# EAGLE schematic LM13700 VCA (EAGLE 7.4.0)
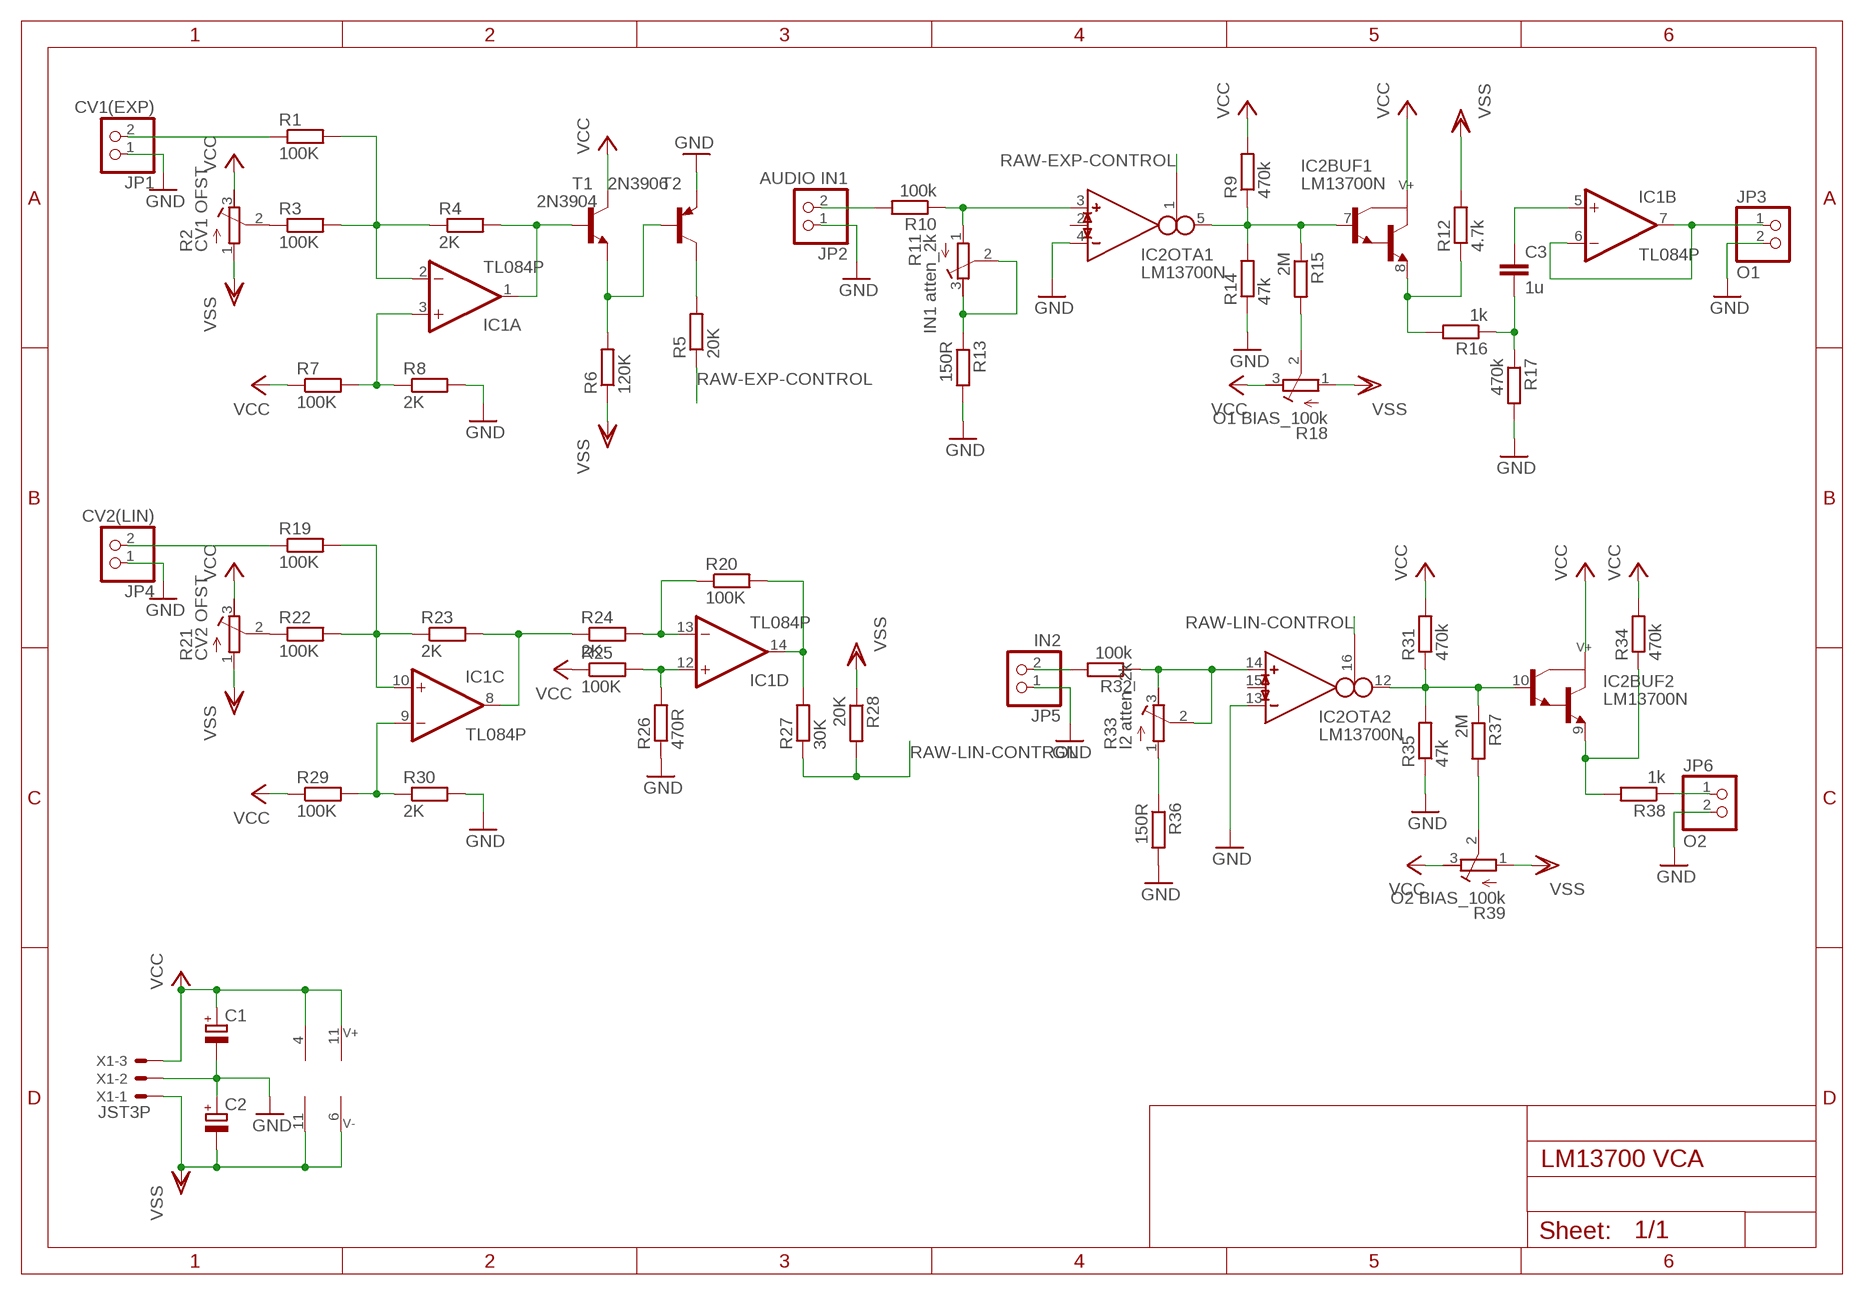
[diagram p0: schematic, sheet 1]

## Parts
C1  CPOL-EUE2.5-7  [E2,5-7]
C2  CPOL-EUE2.5-7  [E2,5-7]
C3  1u  C-EU050-025X075  [C050-025X075]
IC1  TL084P  [DIL14]
IC2  LM13700N  [DIL16]
JP1  CV1(EXP)  PINHD-1X2  [1X02]
JP2  AUDIO IN1  PINHD-1X2  [1X02]
JP3  O1  PINHD-1X2  [1X02]
JP4  CV2(LIN)  PINHD-1X2  [1X02]
JP5  IN2  PINHD-1X2  [1X02]
JP6  O2  PINHD-1X2  [1X02]
R1  100K  R-EU_0204/7  [0204/7]
R2  CV1 OFST  R-TRIMM64W  [RTRIM64W]
R3  100K  R-EU_0204/7  [0204/7]
R4  2K  R-EU_0204/2V  [0204V]
R5  20K  R-EU_0204/7  [0204/7]
R6  120K  R-EU_0204/7  [0204/7]
R7  100K  R-EU_0204/7  [0204/7]
R8  2K  R-EU_0204/7  [0204/7]
R9  470k  R-EU_0204/7  [0204/7]
R10  100k  R-EU_0204/2V  [0204V]
R11  IN1 atten_2k  R-TRIMM64W  [RTRIM64W]
R12  4.7k  R-EU_0204/7  [0204/7]
R13  150R  R-EU_0204/2V  [0204V]
R14  47k  R-EU_0204/7  [0204/7]
R15  2M  R-EU_0204/7  [0204/7]
R16  1k  R-EU_0204/7  [0204/7]
R17  470k  R-EU_0204/7  [0204/7]
R18  O1 BIAS_100k  R-TRIMM64W  [RTRIM64W]
R19  100K  R-EU_0204/7  [0204/7]
R20  100K  R-EU_0204/2V  [0204V]
R21  CV2 OFST  R-TRIMM64W  [RTRIM64W]
R22  100K  R-EU_0204/7  [0204/7]
R23  2K  R-EU_0204/7  [0204/7]
R24  2K  R-EU_0204/7  [0204/7]
R25  100K  R-EU_0204/7  [0204/7]
R26  470R  R-EU_0204/7  [0204/7]
R27  30K  R-EU_0204/7  [0204/7]
R28  20K  R-EU_0204/7  [0204/7]
R29  100K  R-EU_0204/7  [0204/7]
R30  2K  R-EU_0204/7  [0204/7]
R31  470k  R-EU_0204/7  [0204/7]
R32  100k  R-EU_0204/7  [0204/7]
R33  I2 atten_2k  R-TRIMM64W  [RTRIM64W]
R34  470k  R-EU_0204/7  [0204/7]
R35  47k  R-EU_0204/7  [0204/7]
R36  150R  R-EU_0204/7  [0204/7]
R37  2M  R-EU_0204/7  [0204/7]
R38  1k  R-EU_0204/7  [0204/7]
R39  O2 BIAS_100k  R-TRIMM64W  [RTRIM64W]
T1  2N3904  2N3904-NPN-TO92-EBC  [TO92-EBC]
T2  2N3906  2N3906-PNP-TO92-EBC  [TO92-EBC]
X1  JST3P  JST-XH-03-PIN-LONG-PAD  [JST-XH-03-PACKAGE-LONG-PAD]

## Nets
GND: C1.- C2.+ IC2.4(OTA1:IN_N) IC2.13(OTA2:IN_N) JP1.1 JP2.1 JP3.2 JP4.1 JP5.1 JP6.2 R8.2 R13.2 R14.1 R17.2 R26.1 R30.2 R35.1 R36.2 T2.E X1.2
N$1: IC1.3(A:+IN) R7.2 R8.1
N$2: IC1.2(A:-IN) R1.2 R3.2 R4.1
N$3: IC1.1(A:OUT) R4.2 T1.B
N$4: R6.2 T1.E T2.B
N$5: R5.2 T2.C
N$6: JP1.2 R1.1
N$7: R2.2(S) R3.1
N$8: C3.2 R16.1 R17.1
N$9: IC2.3(OTA1:IN_P) R10.1 R11.1(A)
N$11: IC2.14(OTA2:IN_P) R32.1 R33.2(S) R33.3(E)
N$12: IC2.5(OTA1:OUT) IC2.7(BUF1:B) R9.1 R14.2 R15.1
N$13: R15.2 R18.2(S)
N$14: IC2.8(BUF1:E) R12.1 R16.2
N$15: R33.1(A) R36.1
N$16: C3.1 IC1.5(B:+IN)
N$17: IC1.6(B:-IN) IC1.7(B:OUT) JP3.1
N$18: JP2.2 R10.2
N$19: JP5.2 R32.2
N$20: IC1.9(C:-IN) R29.2 R30.1
N$21: IC1.10(C:+IN) R19.2 R22.2 R23.1
N$22: IC1.8(C:OUT) R23.2 R24.1
N$23: JP4.2 R19.1
N$24: R21.2(S) R22.1
N$25: IC1.13(D:-IN) R20.1 R24.2
N$26: IC1.14(D:OUT) R20.2 R27.2
N$27: IC1.12(D:+IN) R25.2 R26.2
N$29: IC2.10(BUF2:B) IC2.12(OTA2:OUT) R31.1 R35.2 R37.1
N$30: R37.2 R39.2(S)
N$31: IC2.9(BUF2:E) R34.1 R38.2
N$32: JP6.1 R38.1
N$37: R11.2(S) R11.3(E) R13.1
RAW-EXP-CONTROL: IC2.1(OTA1:I_BIAS) R5.1
RAW-LIN-CONTROL: IC2.16(OTA2:I_BIAS) R27.1 R28.2
V-: C2.- IC1.11(P:V-) IC2.6(SUPPLY:V-) X1.1 ; supply symbol labelled VSS
VCC: C1.+ IC1.4(P:V+) IC2.11(SUPPLY:V+) R2.3(E) R7.1 R9.2 R18.3(E) R21.3(E) R25.1 R29.1 R31.2 R34.2 R39.3(E) T1.C X1.3
VSS: R2.1(A) R6.1 R12.2 R18.1(A) R21.1(A) R28.1 R39.1(A)
Unconnected: IC2.2(OTA1:I_DIODE) IC2.15(OTA2:I_DIODE)

## Library data of the parts
C1 C2 = rcl:CPOL-EU: POLARIZED CAPACITOR, European symbol
C3 = rcl:C-EU: CAPACITOR, European symbol
IC1 = linear:TL084: OP AMP
IC2 = ota:LM13700: Dual OTA with buffers
JP1-JP6 = pinhead:PINHD-1X2: PIN HEADER
R1 R3-R10 R12-R17 R19 R20 R22-R32 R34-R38 = rcl:R-EU_: RESISTOR, European symbol
R2 R11 R18 R21 R33 R39 = resistor:R-TRIMM: Trimm resistor
T1 = transistor-neu-to92:*-NPN-: NPN Transistror
T2 = transistor-neu-to92:*-PNP-: PNP Transistror
X1 = Rembrandt Electronics - JST XH Connectors v1-0:JST-XH-03-PIN: JST XH Connector 2 Pin Wire to board connector. Pitch: 2,54 mm, (0.100") Number of pins: 3 Created by Rembrandt Electronics www.rembrandtelectronics.com